# EAGLE schematic VF_Sine_CPU_Mainboard (EAGLE 6.6.0)
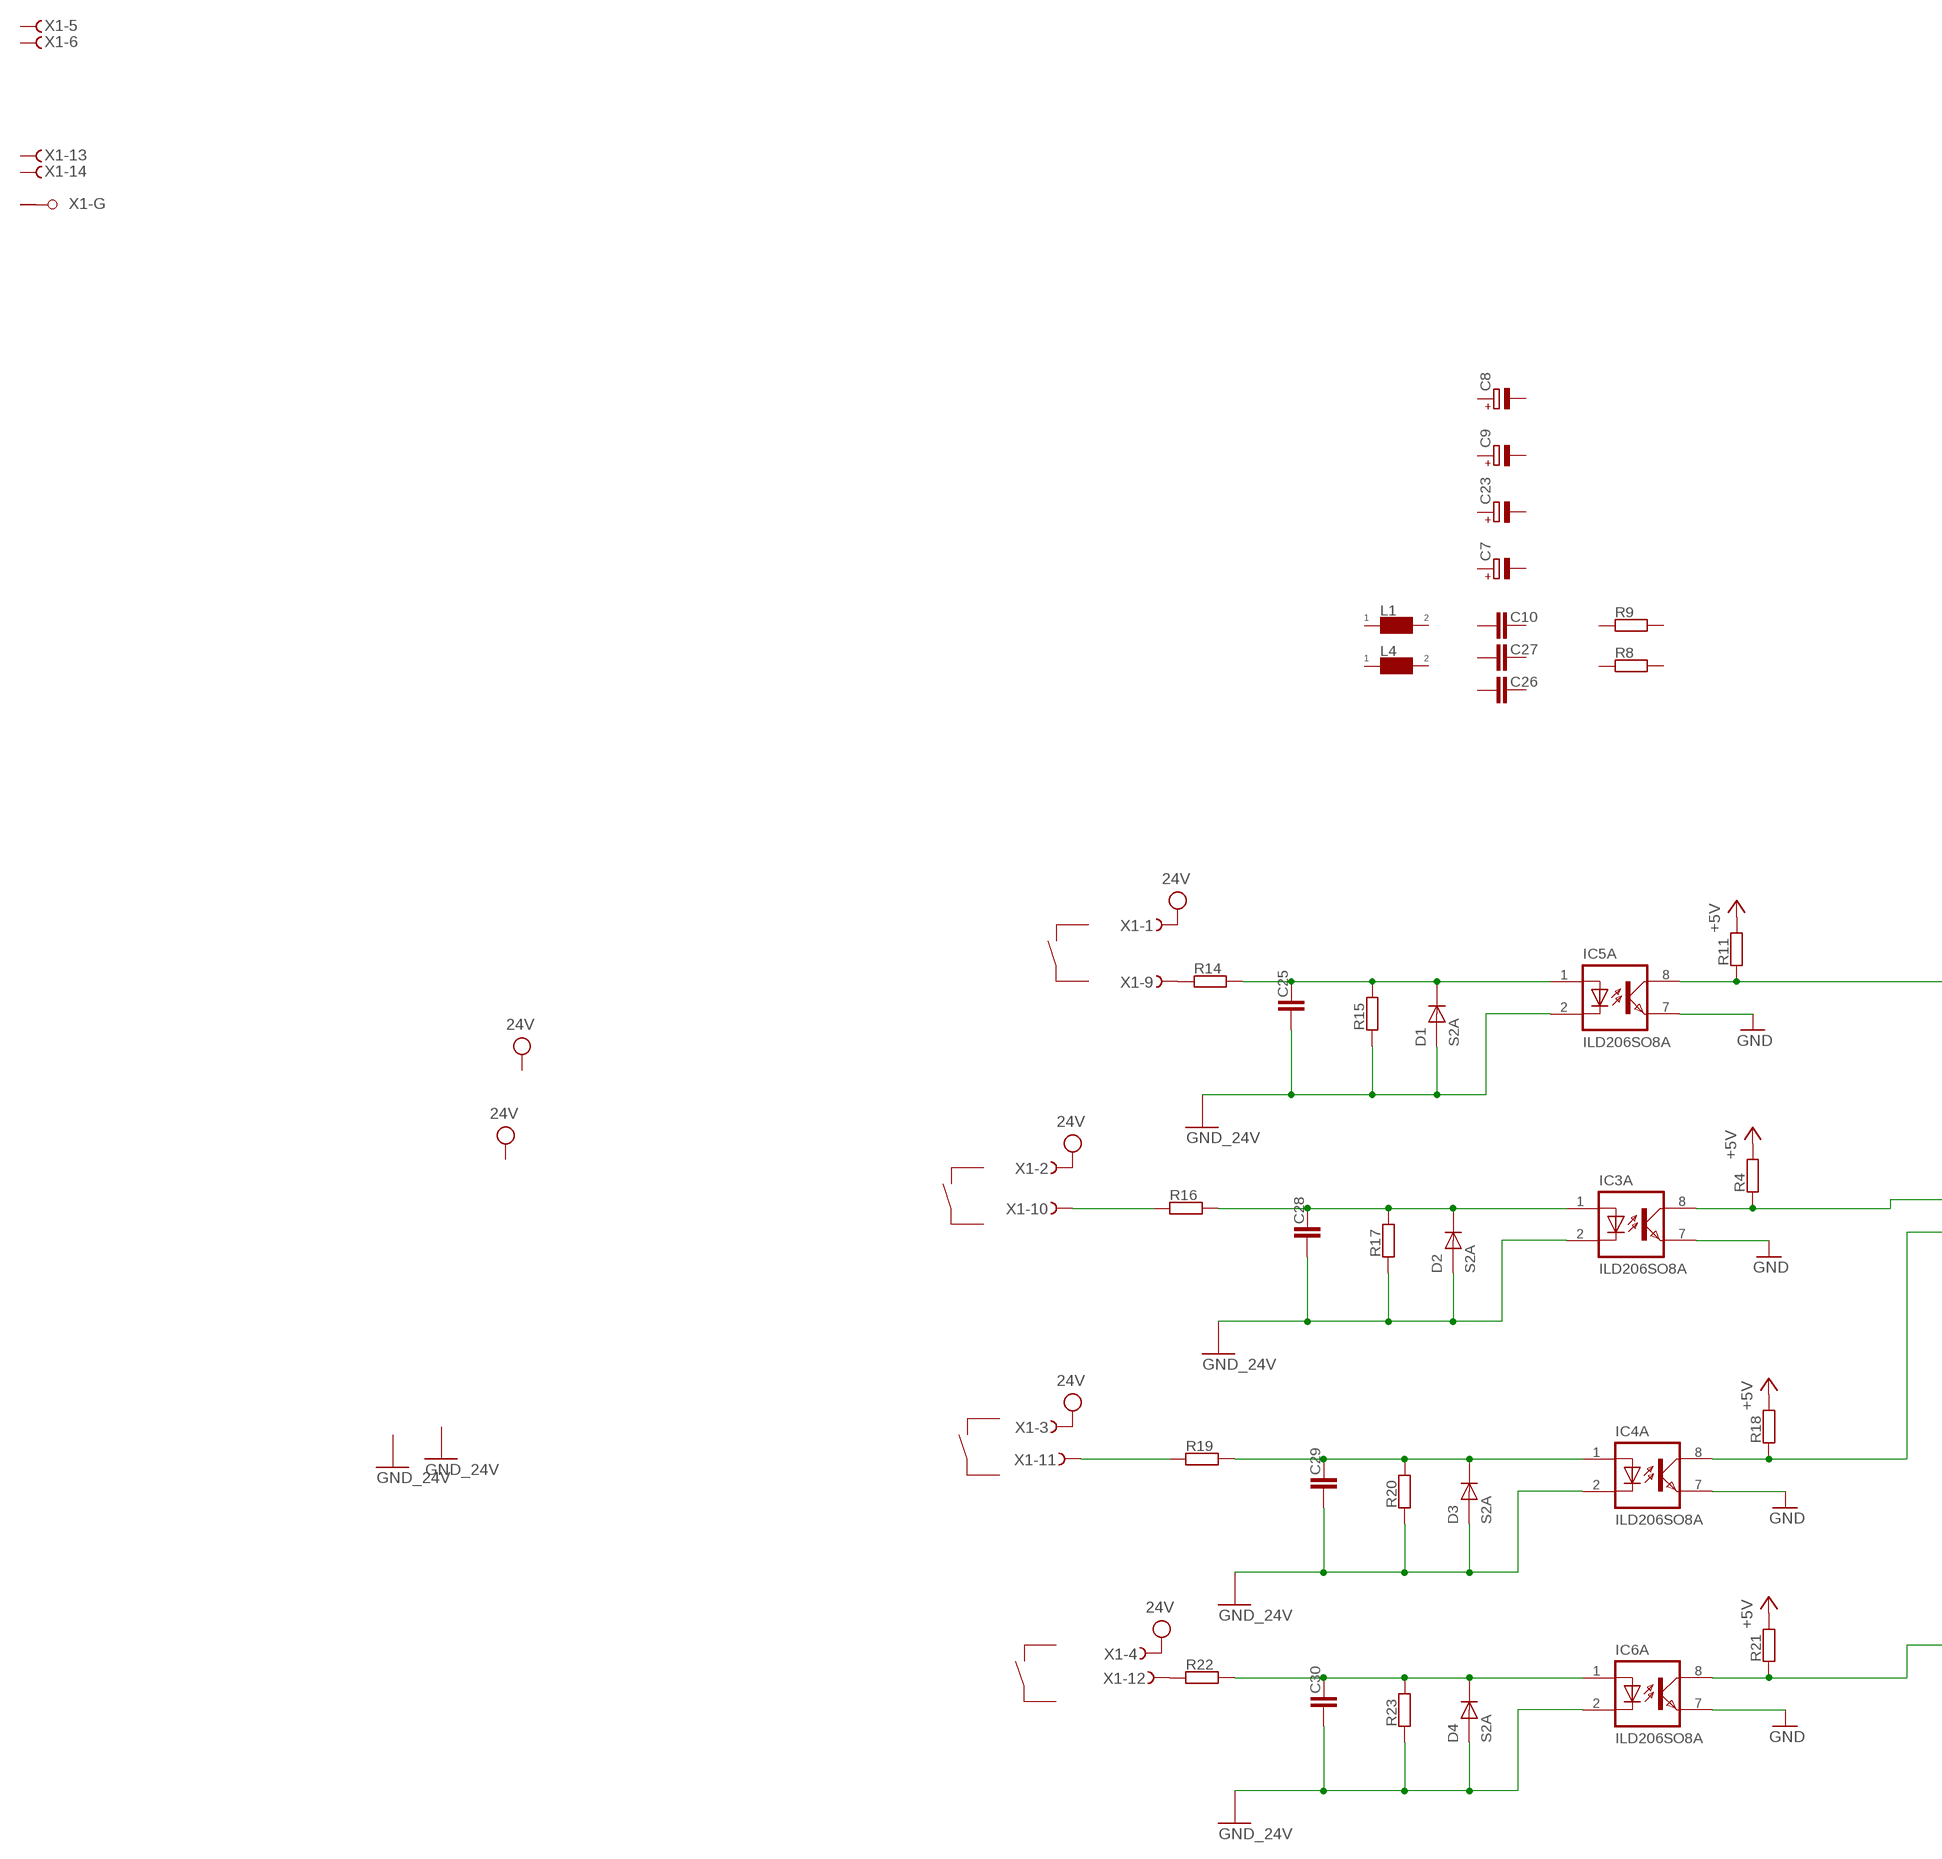
[diagram p0: schematic, sheet 1, part 1 of 3]
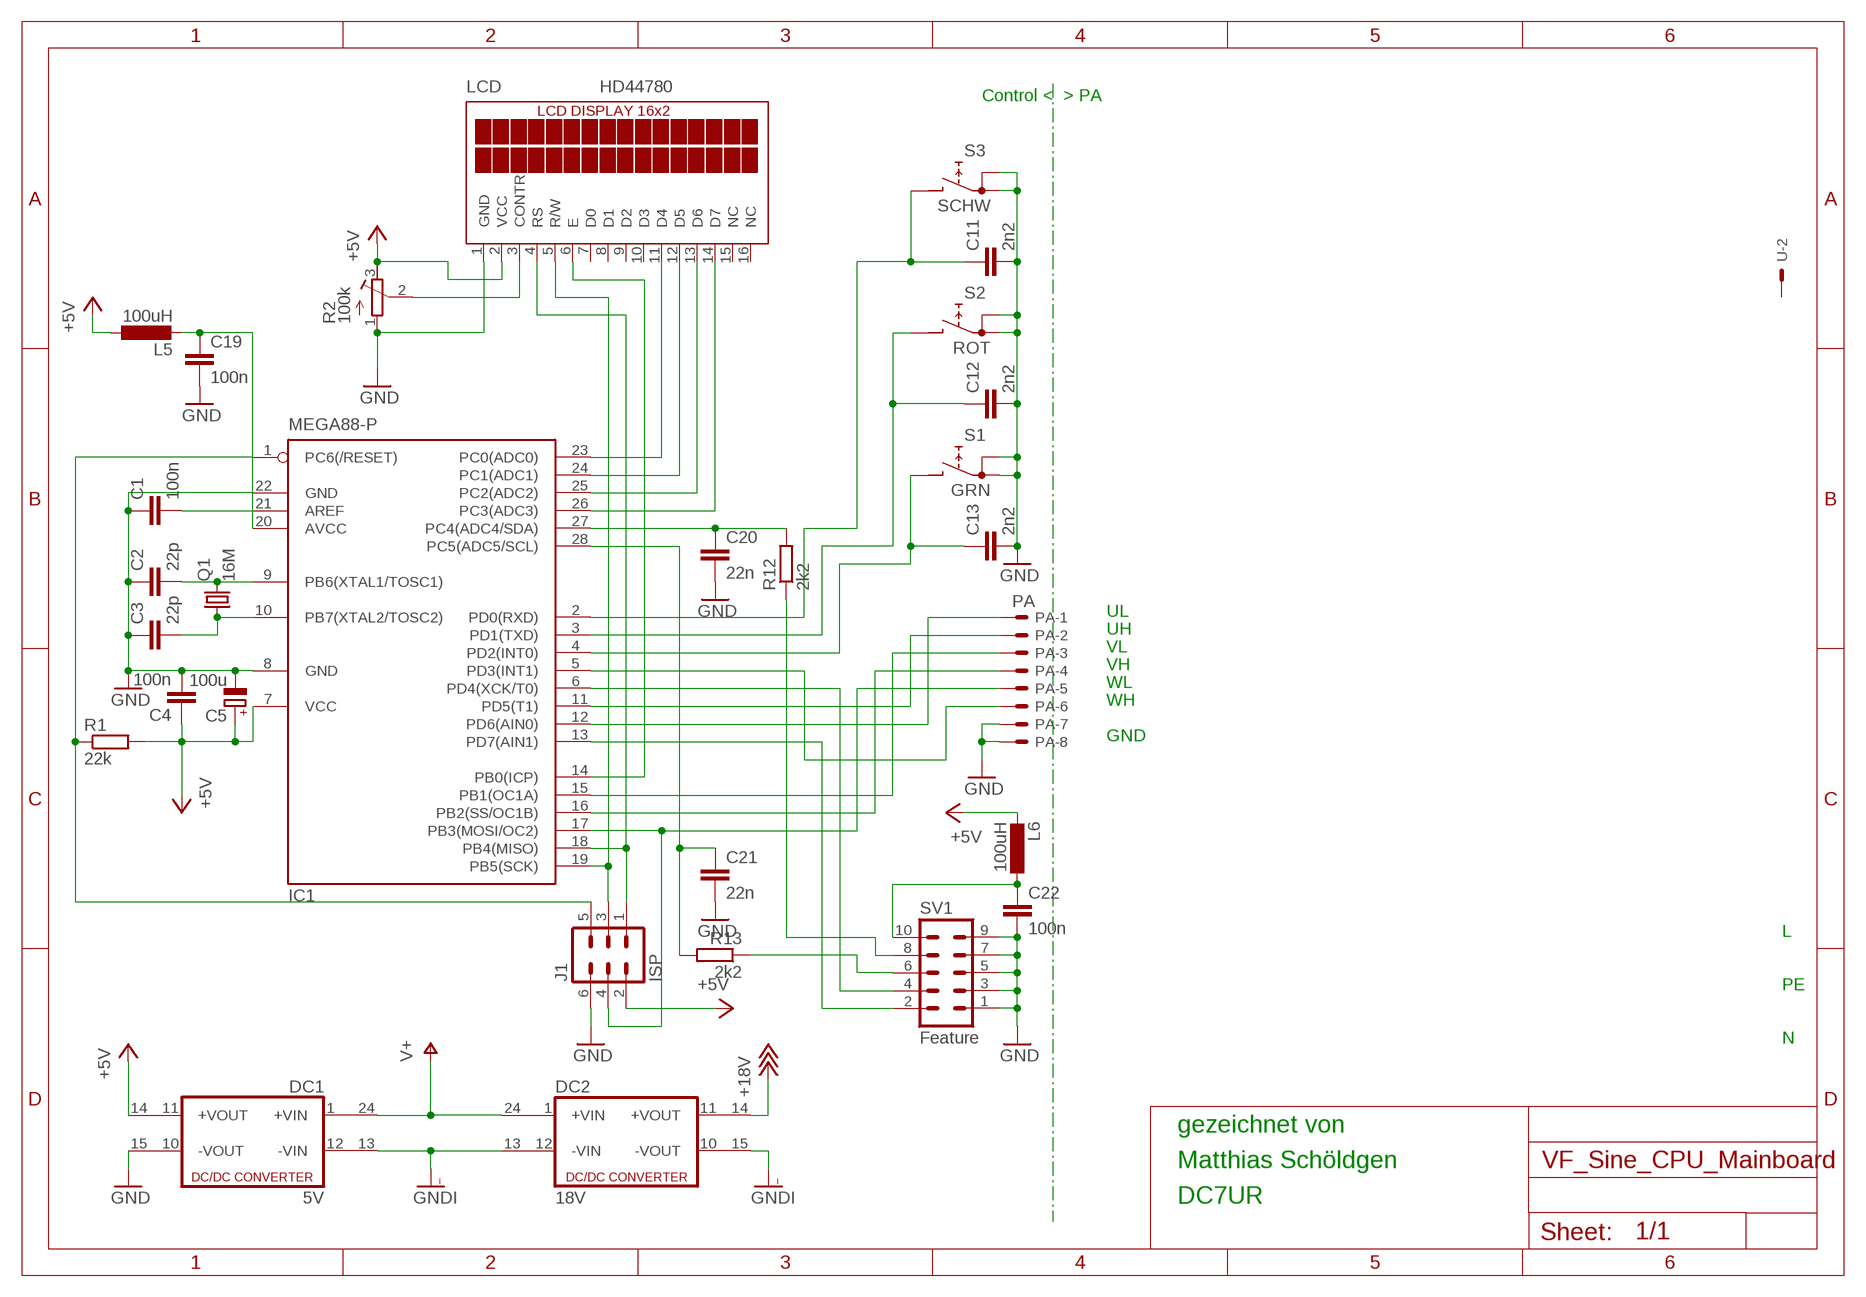
[diagram p1: schematic, sheet 1, part 2 of 3]
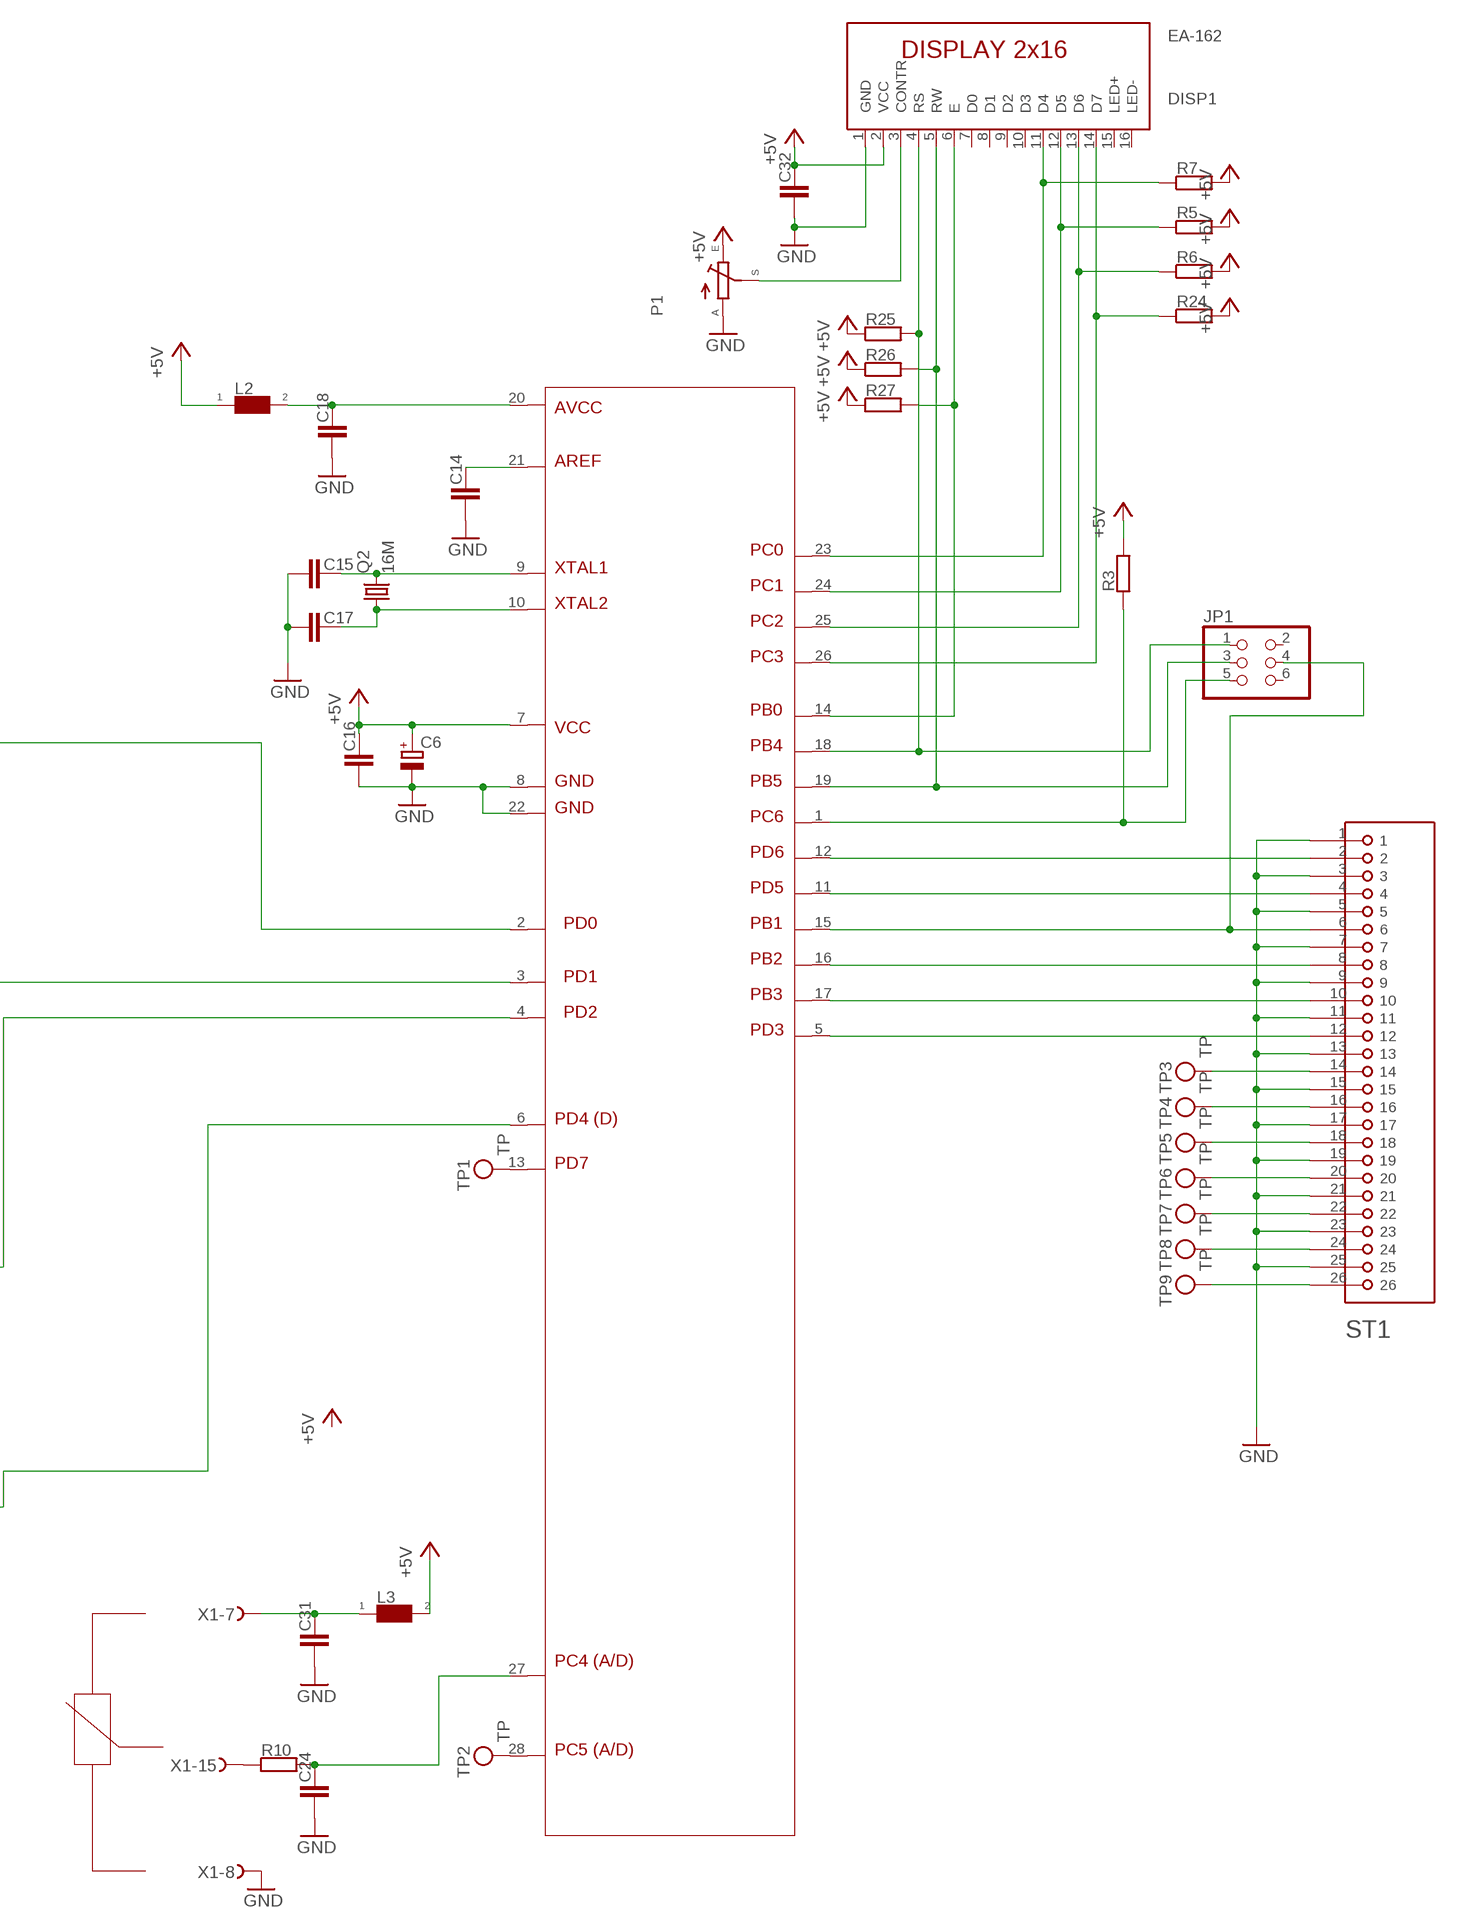
[diagram p2: schematic, sheet 1, part 3 of 3]

## Parts
C1  100n  C-EU025-025X050  [C025-025X050]
C2  22p  C-EU025-025X050  [C025-025X050]
C3  22p  C-EU025-025X050  [C025-025X050]
C4  100n  C-EU025-025X050  [C025-025X050]
C5  100u  CPOL-EUB45181A  [B45181A]
C6  CPOL_EUPANASONIC_D  [PANASONIC_D]
C7  CPOL_EUPANASONIC_D  [PANASONIC_D]
C8  CPOL_EUPANASONIC_D  [PANASONIC_D]
C9  CPOL_EUPANASONIC_D  [PANASONIC_D]
C10  C-EUC0603  [C0603]
C11  2n2  C-EU025-025X050  [C025-025X050]
C12  2n2  C-EU025-025X050  [C025-025X050]
C13  2n2  C-EU025-025X050  [C025-025X050]
C14  C-EUC0603  [C0603]
C15  C-EUC0603  [C0603]
C16  C-EUC0603  [C0603]
C17  C-EUC0603  [C0603]
C18  C-EUC0603  [C0603]
C19  100n  C-EU050-030X075  [C050-030X075]
C20  22n  C-EU025-024X044  [C025-024X044]
C21  22n  C-EU025-024X044  [C025-024X044]
C22  100n  C-EU025-025X050  [C025-025X050]
C23  CPOL_EUPANASONIC_D  [PANASONIC_D]
C24  C-EUC0603  [C0603]
C25  C-EUC0603  [C0603]
C26  C-EUC0603  [C0603]
C27  C-EUC0603  [C0603]
C28  C-EUC0603  [C0603]
C29  C-EUC0603  [C0603]
C30  C-EUC0603  [C0603]
C31  C-EUC0603  [C0603]
C32  C-EUC0603  [C0603]
D1  S2A  [DO214AA]
D2  S2A  [DO214AA]
D3  S2A  [DO214AA]
D4  S2A  [DO214AA]
DC1  5V  DC213R  [CMK]
DC2  18V  DC213R  [CMK]
DISP1  EA-162  [EA-162]
IC1  MEGA88-P  MEGA8-P  [DIL28-3]
IC2  ATMEGA328P_VAR  [DIL-28S]
IC3  ILD206SO8A  [SO8A]
IC4  ILD206SO8A  [SO8A]
IC5  ILD206SO8A  [SO8A]
IC6  ILD206SO8A  [SO8A]
J1  ISP  ML6  [ML6]
JP1  PINHD-2X3  [2X03]
L1  WE-PD2  [WE-PD2-M]
L2  WE-PD2  [WE-PD2-M]
L3  WE-PD2  [WE-PD2-M]
L4  WE-PD2  [WE-PD2-M]
L5  100uH  L-EU0204/5  [0204/5]
L6  100uH  L-EU0204/5  [0204/5]
LCD  HD44780  TUXGR_16X2_R2  [TUXGR_16X2_R2]
P1  TRIM_EU  [S64Y]
PA  PA  22-23-2081  [22-23-2081]
Q1  16M  CRYSTALHC49S  [HC49/S]
Q2  16M  CRYSTALHC49S  [HC49/S]
R1  22k  R-EU_0207/2V  [0207/2V]
R2  100k  R-TRIMM4G/J  [RTRIM4G/J]
R3  R-EUR0603  [R0603]
R4  R-EUR0603  [R0603]
R5  R-EUR0603  [R0603]
R6  R-EUR0603  [R0603]
R7  R-EUR0603  [R0603]
R8  R-EUR0603  [R0603]
R9  R-EUR0603  [R0603]
R10  R-EUR0603  [R0603]
R11  R-EUR0603  [R0603]
R12  2k2  R-EU_0204/5  [0204/5]
R13  2k2  R-EU_0204/5  [0204/5]
R14  R-EUR0603  [R0603]
R15  R-EUR0603  [R0603]
R16  R-EUR0603  [R0603]
R17  R-EUR0603  [R0603]
R18  R-EUR0603  [R0603]
R19  R-EUR0603  [R0603]
R20  R-EUR0603  [R0603]
R21  R-EUR0603  [R0603]
R22  R-EUR0603  [R0603]
R23  R-EUR0603  [R0603]
R24  R-EUR0603  [R0603]
R25  R-EUR0603  [R0603]
R26  R-EUR0603  [R0603]
R27  R-EUR0603  [R0603]
S1  GRN  RDT1034  [RDT1034]
S2  ROT  RDT1034  [RDT1034]
S3  SCHW  RDT1034  [RDT1034]
ST1  HD-26  [HD-26]
SV1  Feature  ML10  [ML10]
TP1  TP  [TP]
TP2  TP  [TP]
TP3  TP  [TP]
TP4  TP  [TP]
TP5  TP  [TP]
TP6  TP  [TP]
TP7  TP  [TP]
TP8  TP  [TP]
TP9  TP  [TP]
U  5566-2  [5566-2]
X1  F15VPS  [F15VP]

## Nets
24V: X1.1(-1:F) X1.2(-2:F) X1.3(-3:F) X1.4(-4:F)
+5V: C4.1 C5.+ C6.+ C16.2 C32.2 DC1.14(+VOUT1) DISP1.2(VCC) IC1.7(VCC) IC2.7 J1.2 L2.1 L3.2 L5.1 L6.2 LCD.2(VCC) P1.E R1.2 R2.3(A) R3.2 R4.2 R5.2 R6.2 R7.2 R11.2 R18.2 R21.2 R24.2 R25.1 R26.1 R27.1
+18V: DC2.14(+VOUT1)
GND: C1.1 C2.1 C3.1 C4.2 C5.- C6.- C11.2 C12.2 C13.2 C14.1 C15.1 C16.1 C17.1 C18.1 C19.2 C20.2 C21.2 C22.2 C24.1 C31.1 C32.1 DC1.15(-VOUT1) DISP1.1(GND) IC1.8(GND) IC1.22(GND) IC2.8 IC2.22 IC3.7(A:EMIT) IC4.7(A:EMIT) IC5.7(A:EMIT) IC6.7(A:EMIT) J1.6 LCD.1(GND) P1.A PA.7 PA.8 R2.1(E) S1.A S1.A1 S2.A S2.A1 S3.A S3.A1 ST1.1 ST1.3 ST1.5 ST1.7 ST1.9 ST1.11 ST1.13 ST1.15 ST1.17 ST1.19 ST1.21 ST1.23 ST1.25 SV1.1 SV1.3 SV1.5 SV1.7 SV1.9 X1.8(-8:F)
GND_24V: C25.1 C28.1 C29.1 C30.1 D1.A D2.A D3.A D4.A IC3.2(A:C) IC4.2(A:C) IC5.2(A:C) IC6.2(A:C) R15.1 R17.1 R20.1 R23.1
GNDI: DC1.13(-VIN1) DC2.13(-VIN1) DC2.15(-VOUT1)
N$1: IC1.18(PB4(MISO)) J1.1 LCD.4(RS)
N$2: IC1.19(PB5(SCK)) J1.3 LCD.5(R/W)
N$3: IC1.17(PB3(MOSI/OC2)) J1.4 PA.5
N$4: IC1.1(PC6(/RESET)) J1.5 R1.1
N$5: IC1.12(PD6(AIN0)) PA.1
N$6: IC1.11(PD5(T1)) PA.2
N$7: IC1.15(PB1(OC1A)) PA.3
N$8: IC1.16(PB2(SS/OC1B)) PA.4
N$9: IC1.5(PD3(INT1)) PA.6
N$10: IC1.23(PC0(ADC0)) LCD.11(D4)
N$11: IC1.24(PC1(ADC1)) LCD.12(D5)
N$12: IC1.25(PC2(ADC2)) LCD.13(D6)
N$13: C1.2 IC1.21(AREF)
N$14: C2.2 IC1.9(PB6(XTAL1/TOSC1)) Q1.2
N$15: C3.2 IC1.10(PB7(XTAL2/TOSC2)) Q1.1
N$16: IC1.26(PC3(ADC3)) LCD.14(D7)
N$17: IC1.13(PD7(AIN1)) SV1.2
N$18: IC1.14(PB0(ICP)) LCD.6(E)
N$19: LCD.3(CONTR) R2.2(S)
N$20: IC1.6(PD4(XCK/T0)) SV1.4
N$21: R12.1 SV1.8
N$22: R13.1 SV1.6
N$23: C13.1 IC1.4(PD2(INT0)) S1.B
N$24: C12.1 IC1.3(PD1(TXD)) S2.B
N$25: C11.1 IC1.2(PD0(RXD)) S3.B
N$26: IC2.28 TP2.TP(TP_13)
N$27: IC2.12 ST1.2
N$28: IC2.11 ST1.4
N$29: IC2.15 JP1.4 ST1.6
N$30: IC2.16 ST1.8
N$31: IC2.17 ST1.10
N$32: IC2.5 ST1.12
N$33: DISP1.4(RS) IC2.18 JP1.1 R25.2
N$34: DISP1.5(RW) IC2.19 JP1.3 R26.2
N$35: IC2.1 JP1.5 R3.1
N$36: C19.1 IC1.20(AVCC) L5.2
N$37: C20.1 IC1.27(PC4(ADC4/SDA)) R12.2
N$38: C21.1 IC1.28(PC5(ADC5/SCL)) R13.2
N$39: DISP1.11(D4) IC2.23 R7.1
N$40: C25.2 D1.K(C) IC5.1(A:A) R14.2 R15.2
N$41: C14.2 IC2.21
N$42: C15.2 IC2.9 Q2.2
N$43: C17.2 IC2.10 Q2.1
N$44: C18.2 IC2.20 L2.2
N$45: DISP1.12(D5) IC2.24 R5.1
N$46: DISP1.13(D6) IC2.25 R6.1
N$47: DISP1.14(D7) IC2.26 R24.1
N$48: DISP1.6(E) IC2.14 R27.2
N$49: IC2.13 TP1.TP(TP_13)
N$51: C22.1 L6.1 SV1.10
N$52: IC2.2 IC5.8(A:COL) R11.1
N$53: C28.2 D2.K(C) IC3.1(A:A) R16.2 R17.2
N$54: C31.2 L3.1 X1.7(-7:F)
N$55: IC2.3 IC3.8(A:COL) R4.1
N$56: C29.2 D3.K(C) IC4.1(A:A) R19.2 R20.2
N$57: R10.1 X1.15(-15:F)
N$58: IC2.4 IC4.8(A:COL) R18.1
N$59: C30.2 D4.K(C) IC6.1(A:A) R22.2 R23.2
N$60: C24.2 IC2.27 R10.2
N$61: IC2.6 IC6.8(A:COL) R21.1
N$62: R14.1 X1.9(-9:F)
N$63: R16.1 X1.10(-10:F)
N$64: R19.1 X1.11(-11:F)
N$65: R22.1 X1.12(-12:F)
N$66: ST1.14 TP3.TP(TP_13)
N$67: ST1.16 TP4.TP(TP_13)
N$68: ST1.20 TP6.TP(TP_13)
N$69: ST1.22 TP7.TP(TP_13)
N$70: ST1.24 TP8.TP(TP_13)
N$71: ST1.26 TP9.TP(TP_13)
N$72: ST1.18 TP5.TP(TP_13)
N$73: DISP1.3(CONTR) P1.S
V+: DC1.24(+VIN1) DC2.24(+VIN1)
Unconnected: C7.+ C7.- C8.+ C8.- C9.+ C9.- C10.1 C10.2 C23.+ C23.- C26.1 C26.2 C27.1 C27.2 DC1.1(+VIN) DC1.10(-VOUT) DC1.11(+VOUT) DC1.12(-VIN) DC2.1(+VIN) DC2.10(-VOUT) DC2.11(+VOUT) DC2.12(-VIN) DISP1.7(D0) DISP1.8(D1) DISP1.9(D2) DISP1.10(D3) DISP1.15(LED+) DISP1.16(LED-) IC3.3(B:A) IC3.4(B:C) IC3.5(B:EMIT) IC3.6(B:COL) IC4.3(B:A) IC4.4(B:C) IC4.5(B:EMIT) IC4.6(B:COL) IC5.3(B:A) IC5.4(B:C) IC5.5(B:EMIT) IC5.6(B:COL) IC6.3(B:A) IC6.4(B:C) IC6.5(B:EMIT) IC6.6(B:COL) JP1.2 JP1.6 L1.1 L1.2 L4.1 L4.2 LCD.7(D0) LCD.8(D1) LCD.9(D2) LCD.10(D3) LCD.15(NC) LCD.16(NC) R8.1 R8.2 R9.1 R9.2 U.1 U.2 X1.5(-5:F) X1.6(-6:F) X1.13(-13:F) X1.14(-14:F) X1.G1(-G:G1) X1.G2(-G:G2)

## Notes on the sheet
- Control <  > PA
- UL
- UH
- VL
- VH
- WL
- WH
- GND
- L
- PE
- N
- gezeichnet von
- Matthias Schöldgen
- DC7UR
- AVCC
- AREF
- PC0
- XTAL1
- PC1
- XTAL2
- PC2
- PC3
- PB0
- VCC
- PB4
- GND | PB5
- GND
- PC6
- PD6
- PD5
- PD0 | PB1
- PB2
- PD1
- PB3
- PD2
- PD3
- PD4 (D)
- PD7
- PC4 (A/D)
- PC5 (A/D)

## Library data of the parts
C1-C4 C11-C13 C19-C22 = rcl:C-EU: CAPACITOR, European symbol
C5 = rcl:CPOL-EU: POLARIZED CAPACITOR, European symbol
C6-C9 C23 = R-C:CPOL_EU
C10 C14-C18 C24-C32 = R-C:C-EU
D1-D4 = DIODE:S2A
DC1 DC2 = dc-dc-converter:DC213R: DC-DC CONVERTER
DISP1 = DISPLAY:EA-162
IC1 = atmel:MEGA8-P: MICROCONTROLLER 8 Kbytes FLASH, 1 kbytes SRAM, 512 bytes EEPROM, USART, 4-channel 10 bit ADC, 2-channel 8 bit ADC Pin compatible with Atmega48, ATMega88, ATMega168 Source: avr.lbr
IC2 = PAL:ATMEGA328P_VAR
IC3-IC6 = OPTOKOPPLER:ILD206
J1 = con-ml:ML6: HARTING
JP1 = pinhead:PINHD-2X3: PIN HEADER
L1-L4 = L:WE-PD2
L5 L6 = rcl:L-EU: INDUCTOR, European symbol
LCD = display-lcd:TUXGR_16X2_R2: Tuxgraphics LCD display 16x2 characters reflective, without background light Source: tuxgr_12x2_r2.pdf
P1 = POT:TRIM_EU
PA = con-molex:22-23-2081: .100" (2.54mm) Center Header - 8 Pin
Q1 Q2 = crystal:CRYSTAL: CRYSTAL
R1 R12 R13 = rcl:R-EU_: RESISTOR, European symbol
R2 = rcl:R-TRIMM: Trimm resistor
R3-R11 R14-R27 = R-C:R-EU
S1-S3 = switch:RDT1034: PUSH SWITCH www.radiohm.com
ST1 = CONNECT:HD-26
SV1 = con-ml:ML10: HARTING
TP1-TP9 = DSPSUPPLY:TP
U = con-molex:5566-2: Mini FIT connector 2 pol Source: http://www.molex.com
X1 = con-subd:F15VPS: SUB-D; OC_FARNELL: unknown; OC_NEWARK: unknown